# Altium schematic sheet 09B KEYBOARD.SchDoc
size 420 x 297 mm
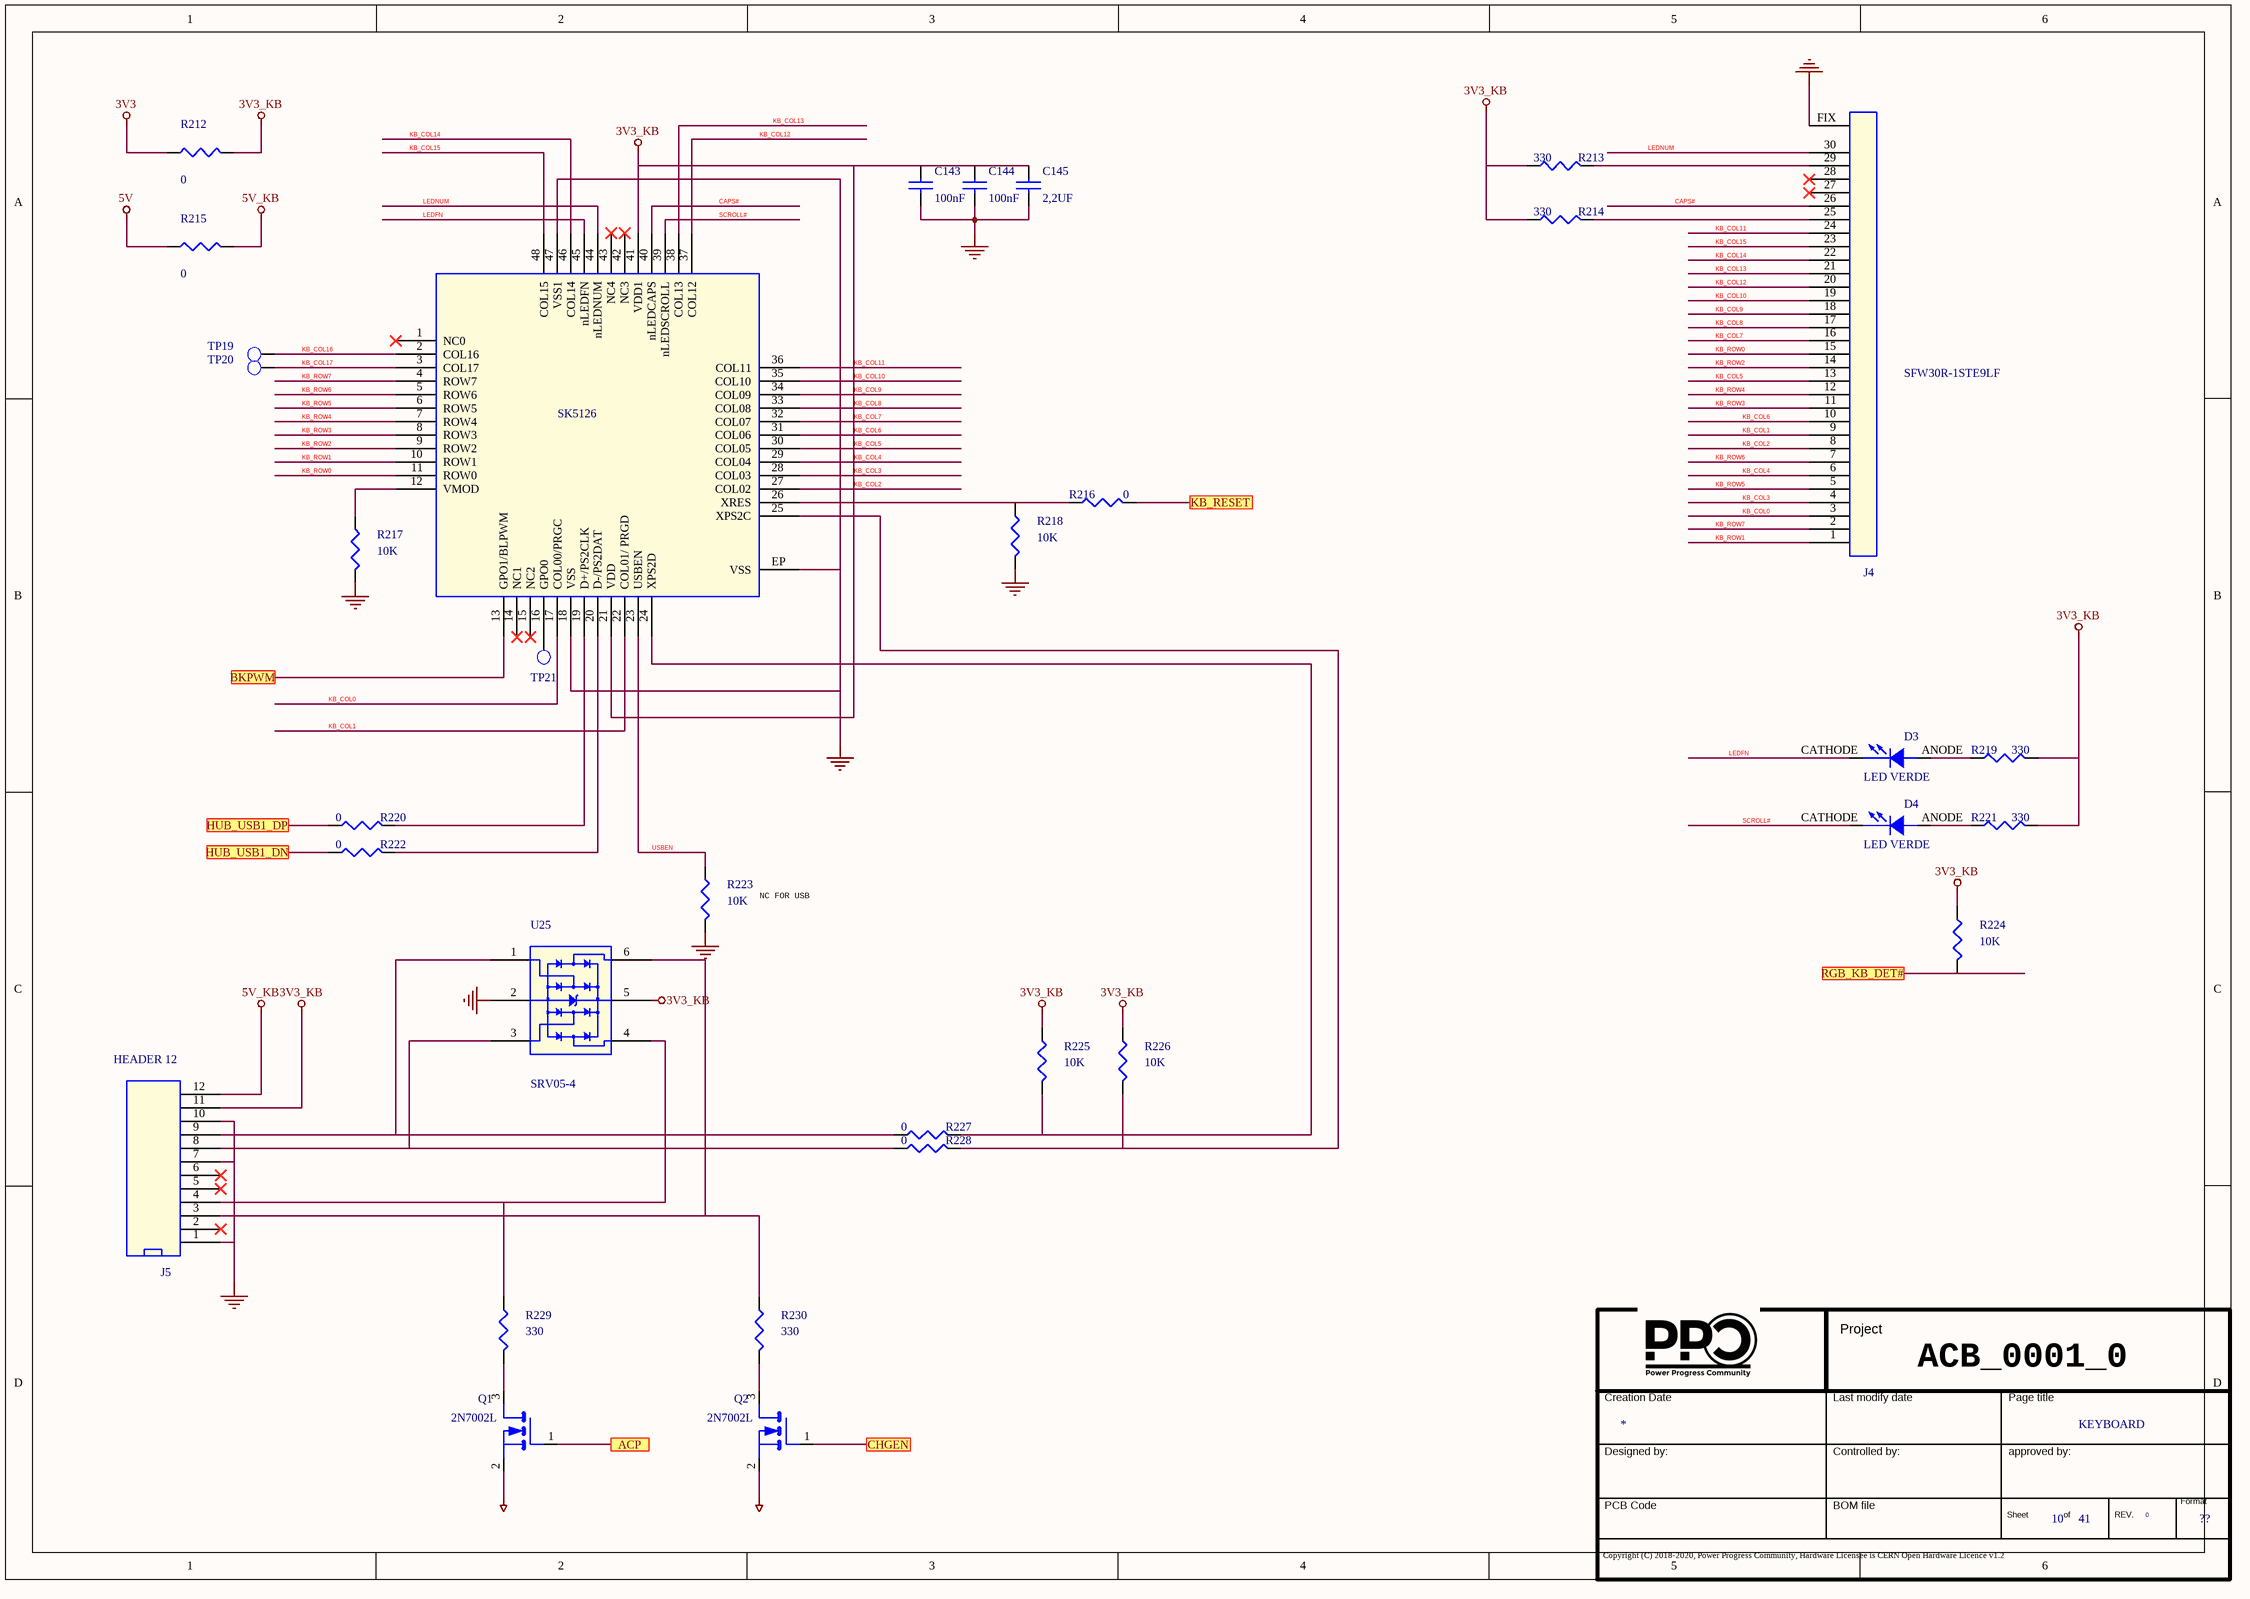
[diagram p0: 09B KEYBOARD.SchDoc]

## Parts
*  Doc: KEYBOARD  Page Count: 41  Page Number: 10  Page Size: ??  RevCode: 0  (hidden comment: Title_block_PPC)  (graphical)
C143  100nF  [SMD_0402]
C144  100nF  [SMD_0402]
C145  2,2UF  [SMD_0402]
D3  LED VERDE  [SMD_0603]
D4  LED VERDE  [SMD_0603]
J4  SFW30R-1STE9LF  [30 PIN PASSO 1mm]
J5  HEADER 12  [SMD_2X50_P=0.635mm]
Q1  2N7002L  [SOT23]
Q2  2N7002L  [SOT23]
R212  0  [SMD_0402]
R213  330  [SMD_0603]
R214  330  [SMD_0603]
R215  0  [SMD_0402]
R216  0  [SMD_0402]
R217  10K  [SMD_0402]
R218  10K  [SMD_0402]
R219  330  [SMD_0603]
R220  0  [SMD_0402]
R221  330  [SMD_0603]
R222  0  [SMD_0402]
R223  10K  [SMD_0402]
R224  10K  [SMD_0402]
R225  10K  [SMD_0402]
R226  10K  [SMD_0402]
R227  0  [SMD_0402]
R228  0  [SMD_0402]
R229  330  [SMD_0402]
R230  330  [SMD_0402]
TP19  TEST POINT  [PCB]  (value not drawn)
TP20  TEST POINT  [PCB]  (value not drawn)
TP21  TEST POINT  [PCB]  (value not drawn)
U24  SK5126  [QFN-48-EP]
U25  SRV05-4  [SOT23-6]

## Ports
ACP, BKPWM, CHGEN, HUB_USB1_DN, HUB_USB1_DP, KB_RESET, RGB_KB_DET#

## Nets
3V3: R212.1
5V: R215.1
5V_KB: J5.12 R215.2
GND: C143.2 C144.2 C145.2 J4.FIX J5.1 J5.7 J5.10 Q1.2 Q2.2 R217.2 R218.2 R223.2 U24.18(VSS) U24.47(VSS1) U24.EP(VSS) U25.2(GND)
KB_COL10: C143.1 C144.1 C145.1 J4.4 J4.6 J4.8 J4.10 J4.13 J4.16 J4.17 J4.18 J4.19 J4.24 J5.11 R212.2 R213.2 R214.2 R219.2 R221.2 R224.1 R225.1 R226.1 U24.21(VDD) U24.27(COL02) U24.28(COL03) U24.29(COL04) U24.30(COL05) U24.31(COL06) U24.32(COL07) U24.33(COL08) U24.34(COL09) U24.35(COL10) U24.36(COL11) U24.41(VDD1) U25.5(VCC)  [also labelled 3V3_KB, KB_COL11, KB_COL2, KB_COL3, KB_COL4, KB_COL5, KB_COL6, KB_COL7, KB_COL8, KB_COL9]
ACP: Q1.1 ; port ACP
BKPWM: U24.13(GPO1/BLPWM) ; port BKPWM
CAPS#: J4.26 U24.40(nLEDCAPS)
CHGEN: Q2.1 ; port CHGEN
HUB_USB1_DN: R222.2 ; port HUB_USB1_DN
HUB_USB1_DP: R220.2 ; port HUB_USB1_DP
KB_COL0: J4.3 U24.17(COL00/PRGC)
KB_COL1: J4.9 U24.22(COL01/_PRGD)
KB_COL12: J4.20 U24.37(COL12)
KB_COL13: J4.21 U24.38(COL13)
KB_COL14: J4.22 U24.46(COL14)
KB_COL15: J4.23 U24.48(COL15)
KB_COL16: TP19.1(TP) U24.2(COL16)
KB_COL17: TP20.1(TP) U24.3(COL17)
KB_RESET: R216.2 ; port KB_RESET
KB_ROW0: J4.15 U24.11(ROW0)
KB_ROW1: J4.1 U24.10(ROW1)
KB_ROW2: J4.14 U24.9(ROW2)
KB_ROW3: J4.11 U24.8(ROW3)
KB_ROW4: J4.12 U24.7(ROW4)
KB_ROW5: J4.5 U24.6(ROW5)
KB_ROW6: J4.7 U24.5(ROW6)
KB_ROW7: J4.2 U24.4(ROW7)
LEDFN: D3.CATHODE U24.45(nLEDFN)
LEDNUM: J4.30 U24.44(nLEDNUM)
RGB_KB_DET#: R224.2 ; port RGB_KB_DET#
SCROLL#: D4.CATHODE U24.39(nLEDSCROLL)
USBEN: R223.1 U24.23(USBEN)
NetD3_ANODE: D3.ANODE R219.1
NetD4_ANODE: D4.ANODE R221.1
NetJ4_25: J4.25 R214.1
NetJ4_29: J4.29 R213.1
NetJ5_3: J5.3 R230.2 U25.6(I/O6)
NetJ5_4: J5.4 R229.2 U25.4(I/O4)
NetJ5_8: J5.8 R228.2 U25.3(I/O3)
NetJ5_9: J5.9 R227.2 U25.1(I/O1)
NetQ1_3: Q1.3 R229.1
NetQ2_3: Q2.3 R230.1
NetR216_1: R216.1 R218.1 U24.26(XRES)
NetR217_1: R217.1 U24.12(VMOD)
NetR220_1: R220.1 U24.19(D+/PS2CLK)
NetR222_1: R222.1 U24.20(D-/PS2DAT)
NetR225_2: R225.2 R227.1 U24.24(XPS2D)
NetR226_2: R226.2 R228.1 U24.25(XPS2C)
NetTP21_1: TP21.1(TP) U24.16(GPO0)

Not connected (* = marked no-connect by the designer): J4 27* 28*; J5 2* 5* 6*; U24 1(NC0)* 14(NC1)* 15(NC2)* 42(NC3)* 43(NC4)*

## Notes on the sheet
- NC FOR USB
- ACB_0001_0
- (in symbol Title_block_PPC) Project; Creation Date; Last modify date; Page title; Designed by:; Controlled by:; approved by:; Format; PCB Code; BOM file; Sheet; of; REV.; Copyright (C) 2018-2020, Power Progress Community, Hardware Licensee is CERN Open Hardware Licence v1.2

## Library data of the parts
* = Title_block_PPC: Title: T2080PCIe; Schematic Page Count: 45; Schematic Page Number: 12; Author: MICETEK; Page Create Date: March  8, 1995; Page Title: ?; Page Modify Date: *
C143 C144 = CAP NP_Dup9: COND.CER. 100NF 50V 0402 X7R SMD; Part Number: PASSIVE_24; Manufacturer 1: TDK; Manufacturer Part Number 1: CGA2B3X7R1H104M050BD; RSM: RC0402; Part Type: Capacitors\Ceramic\SMD\0402; Distributor 1: MODULI ELETTRONICI E COMPONENTI spa; PCB Footprint: SMD_0402
C145 = CAP NP_Dup9: CAP CERAMIC 2.2UF 6.3V X5R 0402; Part Number: PASSIVE_55; Manufacturer 1: Panasonic - ECG; Manufacturer Part Number 1: ECJ-0EB0J225M; RSM: RC0402; Part Type: Capacitors\Ceramic\SMD\0402; Distributor 1: DIGIKEY (PCC2421TR-ND); PCB Footprint: SMD_0402
D3 = LED_2: LED CHIPLED VERDE 40mcd 570nm; Manufacturer Part Number 1: 598-8070-107F; Manufacturer 1: DIALIGHT; Part Number: DISCRETE_31; RSM: LED0603-AK; PCB Footprint: SMD_0603; Distributor 1: MOUSER(645-598-8070-107F); Part Type: Diodes\LED
D4 = LED_2: LED CHIPLED VERDE 40mcd 570nm; Part Number: DISCRETE_31; Manufacturer 1: DIALIGHT; Manufacturer Part Number 1: 598-8070-107F; RSM: LED0603-AK; PCB Footprint: SMD_0603; Part Type: Diodes\LED; Distributor 1: MOUSER(645-598-8070-107F)
J4 = CONN TRBLK 32_1: FFC e FPC 30P SIDE ENTRY SMT 1MM LOWER CONTACT; Manufacturer 1: AMPHENOL; Part Number: CONNECTORS_687; RSM: FCI-SFW30R; Distributor 1: MOUSER(649-SFW30R-1STE9LF); Manufacturer Part Number 1: SFW30R-1STE9LF; Part Type: ZIF; PCB Footprint: 30 PIN PASSO 1mm
J5 = HEADER_12X1: STRIP FEMM.1x12P CS.p=2.54mm SMT; PART NUMBER: CONNECTORS_358; Manufacturer 1: Samtec; Manufacturer Part Number 1: SSM-112-L-SV; RSM: PIN-100MLS-12; PCB Footprint: 12X1P=2.54mm SMT; Part Type: Strip\SOCKET; Distributor 1: DIGIKEY(SAM1148-12-ND )
Q1 Q2 = 2N7002: TRAN NMOS 60V 115MA SOT23; Part Number: DISCRETE_188; Manufacturer 1: ON SEMICONDUCTORS; Manufacturer Part Number 1: 2N7002LT1G; RSM: SOT-23; PCB Footprint: sot23; Part Type: Mosfet\SOT23; Distributor 1: DIGIKEY(2N7002LT3GOSCT-ND)
R212 R215 R220 R222 R227 R228 = R_Dup8: RESIS.CHIP 0R 5% 0402 SMD; Manufacturer 1: ROYAL OHM; Part Number: PASSIVE_805; RSM: RC0402; Distributor 1: CAMEL ELETTRONICA SRL  #; Manufacturer Part Number 1: RESIS.CHIP 0R 5% 0402 SMD; Part Type: Resistors\Fixed\SMD\0402\5%; PCB Footprint: SMD_0402
R213 R214 R219 = R_Dup8: RESIS.CHIP 330R 5% 0603 1/10W SMD; Part Number: PASSIVE_1138; Manufacturer 1: NIC; Manufacturer Part Number 1: NRC06J331TRF; RSM: RC0603; Part Type: Resistors\Fixed\SMD\0603\5%; Distributor 1: MODULI ELETTRONICI E COMPONENTI spa; PCB Footprint: SMD_0603
R216 = R_Dup8: RESIS.CHIP 0R 5% 0402 SMD; Part Number: PASSIVE_805; Manufacturer 1: ROYAL OHM; RSM: RC0402; PCB Footprint: SMD_0402; Part Type: Resistors\Fixed\SMD\0402\5%; Manufacturer Part Number 1: RESIS.CHIP 0R 5% 0402 SMD; Distributor 1: CAMEL ELETTRONICA SRL  #
R217 R218 R223-R226 = R_Dup5: RESIS.CHIP 10K 1% 0402 SMD; Part Number: PASSIVE_584; Manufacturer 1: ROYAL OHM; RSM: RC0402; Part Type: Resistors\Fixed\SMD\0402\1%; PCB Footprint: SMD_0402; Manufacturer Part Number 1: RESIS.CHIP 10K 1% 0402 SMD
R221 = R_Dup8: RESIS.CHIP 330R 5% 0603 1/10W SMD; Manufacturer Part Number 1: NRC06J331TRF; Manufacturer 1: NIC; Part Number: PASSIVE_1138; RSM: RC0603; Distributor 1: MODULI ELETTRONICI E COMPONENTI spa; Part Type: Resistors\Fixed\SMD\0603\5%; PCB Footprint: SMD_0603
R229 R230 = R_Dup5: RESIS.CHIP 330R 5% 0402 SMD; Manufacturer 1: ROYAL OHM; Part Number: PASSIVE_854; RSM: RC0402; Manufacturer Part Number 1: RESIS.CHIP 330R 5% 0402 SMD; PCB Footprint: SMD_0402; Part Type: Resistors\Fixed\SMD\0402\5%
TP19-TP21 = T POINT R: TEST POINT SU PCB; Part Number: CONNECTORS_542; RSM: AE-TESTPOINT; Part Type: Tpoint; PCB Footprint: PCB
U24 = SK5126_0: Industrial usb keyborad controller; Part Number: LOGIC_354; Manufacturer 1: Sprintek; Manufacturer Part Number 1: SK5126-LT / AP2191SG-13; PCB Footprint: QFN-48-EP; Part Type: USB\KEYBOARD; Distributor 1: SPRINGTEK; RSM: QFN-48-EP
U25 = SRV05-4: TVS Diode Array5VWM 17.5VC USB; Manufacturer Part Number 1: SRV05-4.TCT; Manufacturer 1: Semtec; Part Number: DISCRETE_246; CLASS: IC; RSM: SOT-23-6; PCB Footprint: SOT23-6; Distributor 1: DIGIKEY (SRV05-4CT-ND); Part Type: Protections